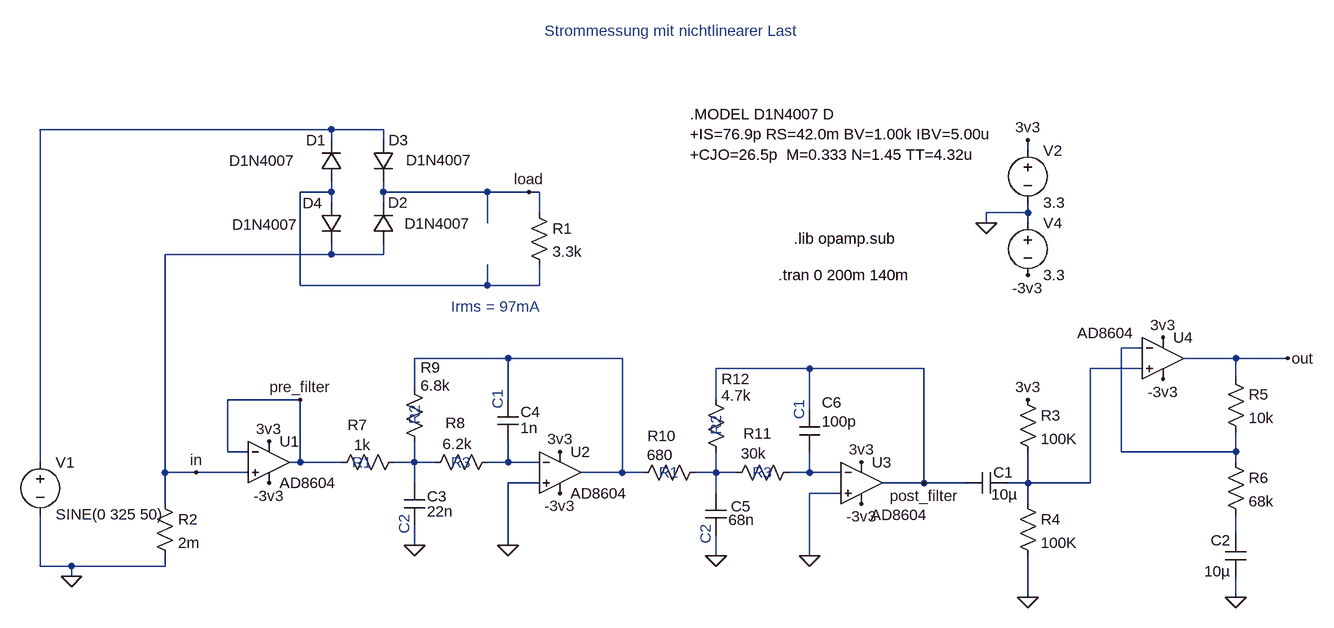
[diagram p0: schematic strommessung_spice_nonlinear_load.asc]
strommessung_spice_nonlinear_load.asc, the LTspice schematic file:
Version 4
SHEET 1 2304 1064
WIRE 528 -336 80 -336
WIRE 608 -336 528 -336
WIRE 528 -320 528 -336
WIRE 608 -320 608 -336
WIRE 1600 -304 1600 -320
WIRE 528 -240 528 -256
WIRE 528 -240 480 -240
WIRE 608 -240 608 -256
WIRE 768 -240 608 -240
WIRE 832 -240 768 -240
WIRE 848 -240 832 -240
WIRE 528 -224 528 -240
WIRE 608 -224 608 -240
WIRE 848 -208 848 -240
WIRE 1600 -208 1600 -224
WIRE 1600 -208 1536 -208
WIRE 768 -192 768 -240
WIRE 1536 -192 1536 -208
WIRE 1600 -192 1600 -208
WIRE 528 -144 528 -160
WIRE 528 -144 272 -144
WIRE 608 -144 608 -160
WIRE 608 -144 528 -144
WIRE 480 -96 480 -240
WIRE 768 -96 768 -128
WIRE 768 -96 480 -96
WIRE 848 -96 848 -128
WIRE 848 -96 768 -96
WIRE 1776 0 1744 0
WIRE 800 16 656 16
WIRE 976 16 800 16
WIRE 1920 16 1840 16
WIRE 2000 16 1920 16
WIRE 1264 32 1120 32
WIRE 1440 32 1264 32
WIRE 1776 32 1696 32
WIRE 1920 48 1920 16
WIRE 656 64 656 16
WIRE 480 80 368 80
WIRE 800 80 800 16
WIRE 1120 80 1120 32
WIRE 1264 96 1264 32
WIRE 368 160 368 80
WIRE 400 160 368 160
WIRE 1744 160 1744 0
WIRE 1920 160 1920 128
WIRE 1920 160 1744 160
WIRE 80 176 80 -336
WIRE 480 176 480 80
WIRE 480 176 464 176
WIRE 544 176 480 176
WIRE 656 176 656 144
WIRE 656 176 624 176
WIRE 688 176 656 176
WIRE 800 176 800 144
WIRE 800 176 768 176
WIRE 848 176 800 176
WIRE 1920 176 1920 160
WIRE 272 192 272 -144
WIRE 320 192 272 192
WIRE 400 192 320 192
WIRE 976 192 976 16
WIRE 976 192 912 192
WIRE 1008 192 976 192
WIRE 1120 192 1120 160
WIRE 1120 192 1088 192
WIRE 1152 192 1120 192
WIRE 1264 192 1264 160
WIRE 1264 192 1232 192
WIRE 1312 192 1264 192
WIRE 656 208 656 176
WIRE 848 208 800 208
WIRE 1440 208 1440 32
WIRE 1440 208 1376 208
WIRE 1504 208 1440 208
WIRE 1600 208 1600 160
WIRE 1600 208 1568 208
WIRE 1696 208 1696 32
WIRE 1696 208 1600 208
WIRE 1120 224 1120 192
WIRE 1312 224 1264 224
WIRE 272 240 272 192
WIRE 1600 240 1600 208
WIRE 1920 288 1920 256
WIRE 656 304 656 272
WIRE 800 304 800 208
WIRE 1120 320 1120 288
WIRE 1264 320 1264 224
WIRE 80 336 80 256
WIRE 128 336 80 336
WIRE 272 336 272 320
WIRE 272 336 128 336
WIRE 128 352 128 336
WIRE 1600 384 1600 320
WIRE 1920 384 1920 352
FLAG 1600 384 0
FLAG 1600 -320 3v3
FLAG 1600 80 3v3
FLAG 1920 384 0
FLAG 128 352 0
FLAG 656 304 0
FLAG 800 304 0
FLAG 1120 320 0
FLAG 1264 320 0
FLAG 1536 -192 0
FLAG 1600 -112 -3v3
FLAG 432 144 3v3
FLAG 880 160 3v3
FLAG 1344 176 3v3
FLAG 1808 -16 3v3
FLAG 432 208 -3v3
FLAG 880 224 -3v3
FLAG 1344 240 -3v3
FLAG 1808 48 -3v3
FLAG 2000 16 out
FLAG 320 192 in
FLAG 1440 208 post_filter
FLAG 832 -240 load
FLAG 480 80 pre_filter
SYMBOL cap 1568 192 R90
WINDOW 0 15 6 VBottom 2
WINDOW 3 18 4 VTop 2
SYMATTR InstName C1
SYMATTR Value 10µ
SYMBOL res 1584 64 R0
SYMATTR InstName R3
SYMATTR Value 100K
SYMBOL res 1584 224 R0
SYMATTR InstName R4
SYMATTR Value 100K
SYMBOL voltage 1600 -320 R0
WINDOW 123 0 0 Left 0
WINDOW 39 0 0 Left 0
SYMATTR InstName V2
SYMATTR Value 3.3
SYMBOL res 1904 32 R0
SYMATTR InstName R5
SYMATTR Value 10k
SYMBOL res 1904 160 R0
SYMATTR InstName R6
SYMATTR Value 68k
SYMBOL cap 1936 352 R180
WINDOW 0 24 56 Left 2
WINDOW 3 24 8 Left 2
SYMATTR InstName C2
SYMATTR Value 10µ
SYMBOL res 528 192 R270
WINDOW 0 58 40 VTop 2
WINDOW 3 58 48 VBottom 2
SYMATTR InstName R7
SYMATTR Value 1k
SYMBOL res 672 192 R270
WINDOW 0 61 47 VTop 2
WINDOW 3 60 50 VBottom 2
SYMATTR InstName R8
SYMATTR Value 6.2k
SYMBOL res 640 48 R0
WINDOW 0 25 -18 Left 2
WINDOW 3 25 10 Left 2
SYMATTR InstName R9
SYMATTR Value 6.8k
SYMBOL cap 640 208 R0
WINDOW 0 35 21 Left 2
WINDOW 3 35 44 Left 2
SYMATTR InstName C3
SYMATTR Value 22n
SYMBOL cap 784 80 R0
WINDOW 0 35 19 Left 2
WINDOW 3 35 43 Left 2
SYMATTR InstName C4
SYMATTR Value 1n
SYMBOL res 992 208 R270
WINDOW 0 57 45 VTop 2
WINDOW 3 59 42 VBottom 2
SYMATTR InstName R10
SYMATTR Value 680
SYMBOL res 1136 208 R270
WINDOW 0 61 48 VTop 2
WINDOW 3 61 42 VBottom 2
SYMATTR InstName R11
SYMATTR Value 30k
SYMBOL res 1104 64 R0
WINDOW 0 24 -16 Left 2
WINDOW 3 24 9 Left 2
SYMATTR InstName R12
SYMATTR Value 4.7k
SYMBOL cap 1104 224 R0
WINDOW 0 39 20 Left 2
WINDOW 3 35 41 Left 2
SYMATTR InstName C5
SYMATTR Value 68n
SYMBOL cap 1248 96 R0
WINDOW 0 35 -12 Left 2
WINDOW 3 35 17 Left 2
SYMATTR InstName C6
SYMATTR Value 100p
SYMBOL voltage 1600 -208 R0
WINDOW 123 0 0 Left 0
WINDOW 39 0 0 Left 0
SYMATTR InstName V4
SYMATTR Value 3.3
SYMBOL res 256 224 R0
SYMATTR InstName R2
SYMATTR Value 2m
SYMBOL Opamps\\AD8604 432 112 R0
SYMATTR InstName U1
SYMBOL Opamps\\AD8604 880 128 R0
SYMATTR InstName U2
SYMBOL Opamps\\AD8604 1344 144 R0
WINDOW 3 14 113 Left 2
SYMATTR InstName U3
SYMBOL Opamps\\AD8604 1808 -48 R0
WINDOW 3 -132 25 Left 2
SYMATTR InstName U4
SYMBOL diode 544 -256 R180
WINDOW 0 24 64 Left 2
WINDOW 3 71 32 Left 2
SYMATTR InstName D1
SYMATTR Value D1N4007
SYMBOL diode 624 -160 R180
WINDOW 0 -22 64 Left 2
WINDOW 3 -119 31 Left 2
SYMATTR InstName D2
SYMATTR Value D1N4007
SYMBOL diode 592 -320 R0
WINDOW 3 51 31 Left 2
SYMATTR Value D1N4007
SYMATTR InstName D3
SYMBOL diode 512 -224 R0
WINDOW 3 -137 34 Left 2
WINDOW 0 -28 1 Left 2
SYMATTR Value D1N4007
SYMATTR InstName D4
SYMBOL res 832 -224 R0
SYMATTR InstName R1
SYMATTR Value 3.3k
SYMBOL voltage 80 160 R0
WINDOW 123 0 0 Left 0
WINDOW 39 0 0 Left 0
SYMATTR InstName V1
SYMATTR Value SINE(0 325 50)
TEXT 1240 -168 Left 2 !.lib opamp.sub
TEXT 560 176 Left 2 ;R1
TEXT 656 88 VRight 2 ;R2
TEXT 712 176 Left 2 ;R3
TEXT 784 64 VRight 2 ;C1
TEXT 640 256 VRight 2 ;C2
TEXT 1032 192 Left 2 ;R1
TEXT 1176 192 Left 2 ;R3
TEXT 1120 104 VRight 2 ;R2
TEXT 856 -488 Left 2 ;Strommessung mit nichtlinearer Last
TEXT 1248 80 VRight 2 ;C1
TEXT 1104 272 VRight 2 ;C2
TEXT 712 -64 Left 2 ;Irms = 97mA
TEXT 1080 -360 Left 2 !.MODEL D1N4007 D \n+IS=76.9p RS=42.0m BV=1.00k IBV=5.00u\n+CJO=26.5p  M=0.333 N=1.45 TT=4.32u
TEXT 1216 -112 Left 2 !.tran 0 200m 140m

The netlist it stands for:
* strommessung_spice_nonlinear_load.asc
C1 N005 post_filter 10µ
R3 3v3 N005 100K
R4 N005 0 100K
V2 3v3 0 3.3
R5 out N003 10k
R6 N003 N010 68k
C2 0 N010 10µ
R7 pre_filter N006 1k
R8 N006 N007 6.2k
R9 N004 N006 6.8k
C3 N006 0 22n
C4 N004 N007 1n
R10 N004 N008 680
R11 N008 N009 30k
R12 post_filter N008 4.7k
C5 N008 0 68n
C6 post_filter N009 100p
V4 0 -3v3 3.3
R2 in 0 2m
XU1 in pre_filter 3v3 -3v3 pre_filter AD8604  ; pins In+ In- V+ V- OUT
XU2 0 N007 3v3 -3v3 N004 AD8604  ; pins In+ In- V+ V- OUT
XU3 0 N009 3v3 -3v3 post_filter AD8604  ; pins In+ In- V+ V- OUT
XU4 N005 N003 3v3 -3v3 out AD8604  ; pins In+ In- V+ V- OUT
D1 N002 N001 D1N4007
D2 in load D1N4007
D3 N001 load D1N4007
D4 N002 in D1N4007
R1 load N002 3.3k
V1 N001 0 SINE(0 325 50)
.model D D
.lib standard.dio
.lib opamp.sub
* R1
* R2
* R3
* C1
* C2
* R1
* R3
* R2
* Strommessung mit nichtlinearer Last
* C1
* C2
* Irms = 97mA
.MODEL D1N4007 D
+IS=76.9p RS=42.0m BV=1.00k IBV=5.00u
+CJO=26.5p  M=0.333 N=1.45 TT=4.32u
.tran 0 200m 140m
.backanno
.end